# Altium schematic sheet TIDA-010933-DCDC-OpAmp.SchDoc
size 431 x 279 mm; Date: Not shown in title block; ApprovedBy: Not shown in title block; CheckedBy: Not shown in title block; Author: Not shown in title block; CompanyName: Not shown in title block; Engineer: Not shown in title block; Organization: Not shown in title block; Address1: Not shown in title block; Address2: Not shown in title block; Address3: Not shown in title block; Address4: Not shown in title block; DocumentNumber: 2; Revision: Use project parameter SCH_Rev; SheetNumber: 5; SheetTotal: 11; PageSetup: Record=PageOptions|CenterHorizontal=True|CenterVertical=True|PrintScale=1.00|XCorrection=1.00|YCorrection=1.00|PrintKind=0|BorderSize=5000000|LeftOffset=0|BottomOffset=0|Orientation=2|PaperLength=1000|PaperWidth=1000|Scale=100|PaperSource=15|PrintQuality=600|MediaType=1|DitherType=10|PaperKind=Letter|PrintScaleMode=1; CurrentTime: Not shown in title block; CurrentDate: Not shown in title block; Time: Not shown in title block; DocumentFullPathAndName: Not shown in title block; DocumentName: Not shown in title block; ModifiedDate: 1/25/2022; ImagePath: Not shown in title block
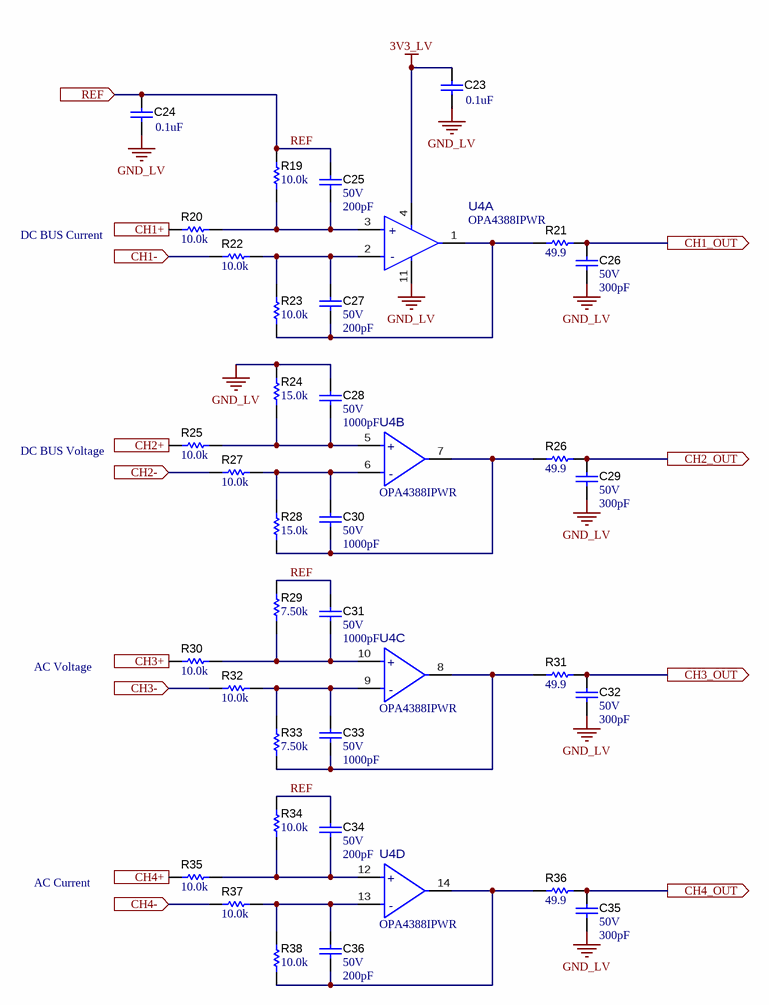
[diagram p0: TIDA-010933-DCDC-OpAmp.SchDoc]

## Parts
C23  ValueDisplayed: 0.1uF  [0402]  (hidden comment: GRM155R71E104KE14D)
C24  ValueDisplayed: 0.1uF  [0402]  (hidden comment: GRM155R71E104KE14D)
C25  VDC_V: 50V  ValueDisplayed: 200pF  [0402]  (hidden comment: GRM1555C1H201JA01D)
C26  VDC_V: 50V  ValueDisplayed: 300pF  [0402]  (hidden comment: GRM1555C1H301JA01D)
C27  VDC_V: 50V  ValueDisplayed: 200pF  [0402]  (hidden comment: GRM1555C1H201JA01D)
C28  VDC_V: 50V  ValueDisplayed: 1000pF  [0402]  (hidden comment: GRM1555C1H102FA01D)
C29  VDC_V: 50V  ValueDisplayed: 300pF  [0402]  (hidden comment: GRM1555C1H301JA01D)
C30  VDC_V: 50V  ValueDisplayed: 1000pF  [0402]  (hidden comment: GRM1555C1H102FA01D)
C31  VDC_V: 50V  ValueDisplayed: 1000pF  [0402]  (hidden comment: GRM1555C1H102FA01D)
C32  VDC_V: 50V  ValueDisplayed: 300pF  [0402]  (hidden comment: GRM1555C1H301JA01D)
C33  VDC_V: 50V  ValueDisplayed: 1000pF  [0402]  (hidden comment: GRM1555C1H102FA01D)
C34  VDC_V: 50V  ValueDisplayed: 200pF  [0402]  (hidden comment: GRM1555C1H201JA01D)
C35  VDC_V: 50V  ValueDisplayed: 300pF  [0402]  (hidden comment: GRM1555C1H301JA01D)
C36  VDC_V: 50V  ValueDisplayed: 200pF  [0402]  (hidden comment: GRM1555C1H201JA01D)
R19  ValueDisplayed: 10.0k  [0402]  (hidden comment: RT0402BRD0710KL)
R20  ValueDisplayed: 10.0k  [0402]  (hidden comment: RT0402BRD0710KL)
R21  ValueDisplayed: 49.9  [0402]  (hidden comment: RC0402FR-0749R9L)
R22  ValueDisplayed: 10.0k  [0402]  (hidden comment: RT0402BRD0710KL)
R23  ValueDisplayed: 10.0k  [0402]  (hidden comment: RT0402BRD0710KL)
R24  ValueDisplayed: 15.0k  [0402]  (hidden comment: ERA-2AEB153X)
R25  ValueDisplayed: 10.0k  [0402]  (hidden comment: RT0402BRD0710KL)
R26  ValueDisplayed: 49.9  [0402]  (hidden comment: RC0402FR-0749R9L)
R27  ValueDisplayed: 10.0k  [0402]  (hidden comment: RT0402BRD0710KL)
R28  ValueDisplayed: 15.0k  [0402]  (hidden comment: ERA-2AEB153X)
R29  ValueDisplayed: 7.50k  [0402]  (hidden comment: ERA-2AEB752X)
R30  ValueDisplayed: 10.0k  [0402]  (hidden comment: RT0402BRD0710KL)
R31  ValueDisplayed: 49.9  [0402]  (hidden comment: RC0402FR-0749R9L)
R32  ValueDisplayed: 10.0k  [0402]  (hidden comment: RT0402BRD0710KL)
R33  ValueDisplayed: 7.50k  [0402]  (hidden comment: ERA-2AEB752X)
R34  ValueDisplayed: 10.0k  [0402]  (hidden comment: RT0402BRD0710KL)
R35  ValueDisplayed: 10.0k  [0402]  (hidden comment: RT0402BRD0710KL)
R36  ValueDisplayed: 49.9  [0402]  (hidden comment: RC0402FR-0749R9L)
R37  ValueDisplayed: 10.0k  [0402]  (hidden comment: RT0402BRD0710KL)
R38  ValueDisplayed: 10.0k  [0402]  (hidden comment: RT0402BRD0710KL)
U4  OPA4388IPWR  [PW0014A-MFG]  (parts A,B,C,D of 4)

## Ports
CH1+ (in), CH1- (in), CH1_OUT (out), CH2+ (in), CH2- (in), CH2_OUT (out), CH3+ (in), CH3- (in), CH3_OUT (out), CH4+ (in), CH4- (in), CH4_OUT (out), REF (in)

## Nets
3V3_LV: C23.1 U4.4(V+)
GND_LV: C23.2 C24.2 C26.2 C28.1 C29.2 C32.2 C35.2 R24.2 U4.11(V-)
CH1+: R20.1 ; port CH1+
CH1-: R22.1 ; port CH1-
CH1_OUT: C26.1 R21.2 ; port CH1_OUT
CH2+: R25.2 ; port CH2+
CH2-: R27.2 ; port CH2-
CH2_OUT: C29.1 R26.2 ; port CH2_OUT
CH3+: R30.2 ; port CH3+
CH3-: R32.2 ; port CH3-
CH3_OUT: C32.1 R31.2 ; port CH3_OUT
CH4+: R35.2 ; port CH4+
CH4-: R37.1 ; port CH4-
CH4_OUT: C35.1 R36.2 ; port CH4_OUT
REF: C24.1 C25.2 C31.1 C34.2 R19.2 R29.2 R34.1 ; port REF
NetC25_1: C25.1 R19.1 R20.2 U4.3(+IN_A)
NetC27_1: C27.1 R21.1 R23.1 U4.1(OUT_A)
NetC27_2: C27.2 R22.2 R23.2 U4.2(-IN_A)
NetC28_2: C28.2 R24.1 R25.1 U4.5(+IN_B)
NetC30_1: C30.1 R27.1 R28.2 U4.6(-IN_B)
NetC30_2: C30.2 R26.1 R28.1 U4.7(OUT_B)
NetC31_2: C31.2 R29.1 R30.1 U4.10(+IN_C)
NetC33_1: C33.1 R32.1 R33.2 U4.9(-IN_C)
NetC33_2: C33.2 R31.1 R33.1 U4.8(OUT_C)
NetC34_1: C34.1 R34.2 R35.1 U4.12(+IN_D)
NetC36_1: C36.1 R36.1 R38.2 U4.14(OUT_D)
NetC36_2: C36.2 R37.2 R38.1 U4.13(-IN_D)

## Notes on the sheet
- DC BUS Current
- DC BUS Voltage
- AC Voltage
- AC Current
- Drawn By:
- SVN Rev:
- Number:
- TID #:
- Orderable:
- Rev:
- Sheet Title:
- File:
- Project Title:
- Designed for:
- Assembly Variant:
- Mod. Date:
- Sheet:
- Size:
- of
- B
- http://www.ti.com
- Texas Instruments and/or its licensors do not warrant the accuracy or completeness of this specification or any information contained therein. Texas Instruments and/or its licensors do not warrant that this design will meet the specifications, will be suitable for your application or fit for any particular purpose, or will operate in an implementation. Texas Instruments and/or its licensors do not warrant that the design is production worthy. You should completely validate and test your design implementation to confirm the system functionality for your application.
- Engineer:
- Contact:
- © Texas Instruments
- (in symbol CMP-0121217-1, part A) +; -
- (in symbol CMP-0121217-1, part B) +; -
- (in symbol CMP-0121217-1, part C) +; -
- (in symbol CMP-0121217-1, part D) +; -

## Library data of the parts
C23 C24 = CMP-0006659-2: CAP, CERM, 0.1 uF, 25 V, +/- 10%, X7R, 0402; Manufacturer: MuRata; TaMin_C: -55°C; Polarized: N; SizeAreaWB_mm2: 3; Value1: Unknown; U/M: EA; Value: 0.1uF; TaMax_C: 125°C; SizeZ_mm: 0.6; SizeX_mm: 1; SizeY_mm: 0.5; Value2: 25V; Cap_F: 100nF; AEC Category: Q200; Supplier Part Number 2: 31Y1751; Publisher: Texas Instruments; Supplier 2: Newark; Supplier Part Number 3: 81-GRM155R71E104KE4D; TempCo: X7R; Supplier 3: Mouser; Published: 2008-06-19; RoHS: Y; MountType: SMT; Supplier 1: Digi-Key; PackageReference: 0402; Tolerance_%: 10%; Cap_Case: 0402; SizeArea_mm2: 0.5; CompType: Capacitor; LatestRevisionDate: 2017-03-09; PartNumber: GRM155R71E104KE14D; AEC Qualified: N; VDC_V: 25V; ComponentLink1Description: Datasheet link; AEC Grade: N/A; Supplier Part Number 1: 490-10698-1-ND; Technology: Ceramic; ComponentLink1URL: http://search.murata.co.jp/Ceramy/image/img/A01X/G101/ENG/GRM155R71E104KE14-01.pdf
C25 C27 C34 C36 = CMP-0006437-2: CAP, CERM, 200 pF, 50 V, +/- 5%, C0G/NP0, 0402; Manufacturer: MuRata; TaMin_C: -55°C; Polarized: N; SizeAreaWB_mm2: 3; Value1: Unknown; U/M: EA; Value: 200pF; TaMax_C: 125°C; SizeZ_mm: 0.6; SizeX_mm: 1; SizeY_mm: 0.5; AEC Category: Q200; Supplier Part Number 2: 81-GRM1555C1H201JA1D; Publisher: Texas Instruments; Supplier 2: Mouser; TempCo: C0G/NP0; Published: 2008-06-19; RoHS: Y; MountType: SMT; Supplier 1: Digi-Key; PackageReference: 0402; Tolerance_%: 5%; Cap_Case: 0402; Value2: 50V; SizeArea_mm2: 0.5; CompType: Capacitor; LatestRevisionDate: 2017-03-09; PartNumber: GRM1555C1H201JA01D; AEC Qualified: ?; Cap_F: 200pF; ComponentLink1Description: Datasheet link; Supplier Part Number 1: 490-3232-1-ND; Technology: Ceramic; ComponentLink1URL: http://search.murata.co.jp/Ceramy/PnsearchViewAction.do?HnOFG=ON&HnNFG=ON&SEL_CNT=50&sLang=en&sKey=GRM1555C1H201JA01D&x=9&y=9&search=startwith
C26 C29 C32 C35 = CMP-0006453-2: CAP, CERM, 300 pF, 50 V, +/- 5%, C0G/NP0, 0402; Manufacturer: MuRata; TaMin_C: -55°C; Polarized: N; SizeAreaWB_mm2: 3; Value1: Unknown; U/M: EA; Value: 300pF; TaMax_C: 125°C; SizeZ_mm: 0.6; SizeX_mm: 1; SizeY_mm: 0.5; AEC Category: Q200; Supplier Part Number 2: 81-GRM1555C1H301JA1D; Publisher: Texas Instruments; Supplier 2: Mouser; TempCo: C0G/NP0; Published: 2008-06-19; RoHS: Y; MountType: SMT; Supplier 1: Digi-Key; PackageReference: 0402; Tolerance_%: 5%; Cap_Case: 0402; Value2: 50V; SizeArea_mm2: 0.5; CompType: Capacitor; LatestRevisionDate: 2017-03-09; PartNumber: GRM1555C1H301JA01D; AEC Qualified: ?; Cap_F: 300pF; ComponentLink1Description: Datasheet link; Supplier Part Number 1: 490-3234-1-ND; Technology: Ceramic; ComponentLink1URL: http://search.murata.co.jp/Ceramy/PnsearchViewAction.do?HnOFG=ON&HnNFG=ON&SEL_CNT=50&sLang=en&sKey=GRM1555C1H301JA01D&x=9&y=9&search=startwith
C28 C30 C31 C33 = CMP-0006411-2: CAP, CERM, 1000 pF, 50 V, +/- 1%, C0G/NP0, 0402; Manufacturer: MuRata; TaMin_C: -55°C; Polarized: N; SizeAreaWB_mm2: 3; Value1: Unknown; U/M: EA; Value: 1000pF; TaMax_C: 125°C; SizeZ_mm: 0.6; SizeX_mm: 1; SizeY_mm: 0.5; Cap_F: 1nF; AEC Category: Q200; Supplier Part Number 2: 45Y5213; Publisher: Texas Instruments; Supplier 2: Newark; Supplier Part Number 3: 81-GRM1555C1H102FA1D; TempCo: C0G/NP0; Supplier 3: Mouser; Published: 2008-06-19; RoHS: Y; MountType: SMT; Supplier 1: Digi-Key; PackageReference: 0402; Tolerance_%: 1%; Cap_Case: 0402; Value2: 50V; SizeArea_mm2: 0.5; CompType: Capacitor; LatestRevisionDate: 2017-03-09; PartNumber: GRM1555C1H102FA01D; AEC Qualified: N; ComponentLink1Description: Datasheet link; AEC Grade: N/A; Supplier Part Number 1: 490-6189-1-ND; Technology: Ceramic; ComponentLink1URL: http://search.murata.co.jp/Ceramy/image/img/A01X/G101/ENG/GRM1555C1H102FA01-01.pdf
R19 R20 R22 R23 R25 R27 R30 R32 R34 R35 R37 R38 = CMP-0065360-1: RES, 10.0 k, .1%, .0625 W, 0402; Manufacturer: Yageo America; Power_W: 62.5mW; TempCo: 25 ppm/C; Value_Code: 10k0; U/M: EA; Value: 10.0k; EIA_Code: E192; Tolerance_%: 0.1%; Res_ohm: 10k; SizeX_mm: 1.0; SizeY_mm: 0.5; SizeZ_mm: 0.6; Value2: .0625W; VDC_V: 50V; AEC Category: Q200; ComponentLink1URL: http://www.yageo.com/NewPortal/yageodocoutput?fileName=/pdf/R-Chip/PYu-RT_1-to-0.01_RoHS_L_8.pdf; Supplier Part Number 2: 66R6774; Publisher: Texas Instruments; Supplier 2: Newark; Supplier Part Number 3: 603-RT0402BRD0710KL; Supplier 3: Mouser; Published: 2008-06-26; RoHS: Y; Value1: .1%; MountType: SMT; Supplier 1: Digi-Key; PackageReference: 0402; SizeArea_mm2: 0.5; CompType: Resistor; LatestRevisionDate: 2017-06-05; PartNumber: RT0402BRD0710KL; AEC Qualified: ?; ComponentLink1Description: Datasheet link; Supplier Part Number 1: YAG1346CT-ND; Technology: Thin Film
R21 R26 R31 R36 = CMP-0026738-1: RES, 49.9, 1%, 0.063 W, 0402; Manufacturer: Yageo America; Power_W: 63mW; TempCo: 100 ppm/C; Value_Code: 49R9; U/M: EA; Value: 49.9; EIA_Code: E96; SizeX_mm: 1; SizeY_mm: 0.5; SizeZ_mm: 0.6; Value2: 0.063W; AEC Qualified: N; VDC_V: 50V; AEC Category: Q200; ComponentLink1URL: http://www.yageo.com/documents/recent/PYu-RC_Group_51_RoHS_L_1.pdf; Supplier Part Number 2: 67R9942; Publisher: Texas Instruments; Supplier 2: Newark; Supplier Part Number 3: 603-RC0402FR-0749R9L; Supplier 3: Mouser; Published: 2008-06-26; RoHS: Y; Value1: 1%; MountType: SMT; Supplier 1: Digi-Key; PackageReference: 0402; Tolerance_%: 1%; Res_ohm: 49.9; SizeArea_mm2: 0.5; CompType: Resistor; LatestRevisionDate: 2017-03-09; PartNumber: RC0402FR-0749R9L; ComponentLink1Description: Datasheet link; AEC Grade: N/A; Supplier Part Number 1: 311-49.9LRCT-ND; Technology: Thick Film
R24 R28 = CMP-0065359-1: RES, 15.0 k, .1%, .063 W, AEC-Q200 Grade 0, 0402; Manufacturer: Panasonic; Power_W: 63mW; TempCo: 25 ppm/C; Value_Code: 15k0; U/M: EA; Value: 15.0k; EIA_Code: E192; Tolerance_%: 0.1%; Res_ohm: 15k; SizeX_mm: 1.0; SizeY_mm: 0.5; SizeZ_mm: 0.6; Value2: .063W; AEC Qualified: Y; VDC_V: 50V; AEC Grade: 0; AEC Category: Q200; ComponentLink1URL: https://industrial.panasonic.com/cdbs/www-data/pdf/RDM0000/AOA0000C237.pdf; Supplier Part Number 2: 53W8333; Publisher: Texas Instruments; Supplier 2: Newark; Supplier Part Number 3: 667-ERA-2AEB153X; Supplier 3: Mouser; Published: 2008-06-26; RoHS: Y; Value1: .1%; MountType: SMT; Supplier 1: Digi-Key; PackageReference: 0402; SizeArea_mm2: 0.5; CompType: Resistor; LatestRevisionDate: 2017-06-05; PartNumber: ERA-2AEB153X; ComponentLink1Description: Datasheet link; Supplier Part Number 1: P15KDCCT-ND; Technology: Thin Film
R29 R33 = CMP-0026786-1: RES, 7.50 k, 0.1%, 0.063 W, AEC-Q200 Grade 0, 0402; Manufacturer: Panasonic; Power_W: 63mW; TempCo: 25 ppm/C; Value_Code: 7k50; U/M: EA; Value: 7.50k; EIA_Code: E192; Res_ohm: 7.5k; SizeX_mm: 1; SizeY_mm: 0.5; SizeZ_mm: 0.6; Value2: 0.063W; AEC Qualified: Y; VDC_V: 50V; AEC Grade: 0; AEC Category: Q200; ComponentLink1URL: http://industrial.panasonic.com/lecs/www-data/pdf/AOA0000/AOA0000CE26.pdf; Supplier Part Number 2: 49W8962; Publisher: Texas Instruments; Supplier 2: Newark; Supplier Part Number 3: 667-ERA-2AEB752X; Supplier 3: Mouser; Published: 2008-06-26; RoHS: Y; Value1: 0.1%; MountType: SMT; Supplier 1: Digi-Key; PackageReference: 0402; Tolerance_%: 0.1%; SizeArea_mm2: 0.5; CompType: Resistor; LatestRevisionDate: 2017-03-09; PartNumber: ERA-2AEB752X; ComponentLink1Description: Datasheet link; Supplier Part Number 1: P7.5KDCCT-ND; Technology: Thin Film
U4 = CMP-0121217-1: Zero-Drift Amplifier 4 Circuit Rail-to-Rail 14-TSSOP; Manufacturer: Texas Instruments; SizeZ_mm: 1.2mm; AEC Qualified: No; Gain Bandwidth: 10MHz; Input Bias Current: 0.00003uA; Input Offset Voltage: 0.00225mV; Max Dual Supply Voltage: 2.75V; Max Supply Voltage: 5.5V; Min Dual Supply Voltage: 1.25V; Min Supply Voltage: 2.5V; Nominal Supply Current: 1.7-1.9mA; Number Of Channels: 4; Output Current Per Channel: 60mA; Response Time: 0.75us; Standoff Height: 0.05mm; TaMax_C: +150°C; TaMin_C: -55°C; Voltage Gain: 126dB; PackageReference: TSSOP14; PartNumber: OPA4388IPWR; RoHS: TRUE; Operating Temperature Range: -40°C to +125°C; Part Number: OPA4388IPWR; datasheet: https://www.ti.com/lit/ds/symlink/opa4388.pdf?ts=1615809516959&ref_url=https%253A%252F%252Fwww.ti.com%252Fproduct%252FOPA4388%253FkeyMatch%253DOPA4388IPWR%2526tisearch%253DSearch-EN-everything%2526usecase%253DOPN; Datasheet Path: datasheets/IC-OPA4388IPWR.pdf; Digikey Description: IC OPAMP ZER-DRIFT 4CIRC 14TSSOP; Digikey Part Number: 296-OPA4388IPWRCT-ND; helpURL: https://upverter.com/upn/revision/38c17684e2773244/; Lead Free: Yes; Mouser Description: Op Amp Quad Zero Drift Amplifier R-R I/O ±2.75V/5.5V 14-Pin TSSOP T/R; Mouser Part Number: 595-OPA4388IPWR; TJmax_C: +150°C; ComponentLink1Description: Datasheet; ComponentLink1URL: https://www.ti.com/lit/ds/symlink/opa4388.pdf?ts=1615809516959&ref_url=https%253A%252F%252Fwww.ti.com%252Fproduct%252FOPA4388%253FkeyMatch%253DOPA4388IPWR%2526tisearch%253DSearch-EN-everything%2526usecase%253DOPN